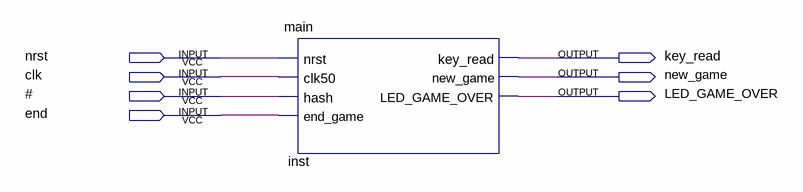
[diagram p0: schematic sheet]
// Quartus schematic Main_sim.bdf as structural Verilog: 1 symbols, 7 pins
module Main_sim (
  input  nrst,
  input  clk,
  input  \# ,
  input  \end ,
  output key_read,
  output new_game,
  output LED_GAME_OVER
);

  main inst (
    .nrst(nrst), .clk50(clk), .hash(\# ), .end_game(\end ), .key_read(key_read), .new_game(new_game),
    .LED_GAME_OVER(LED_GAME_OVER));
endmodule
